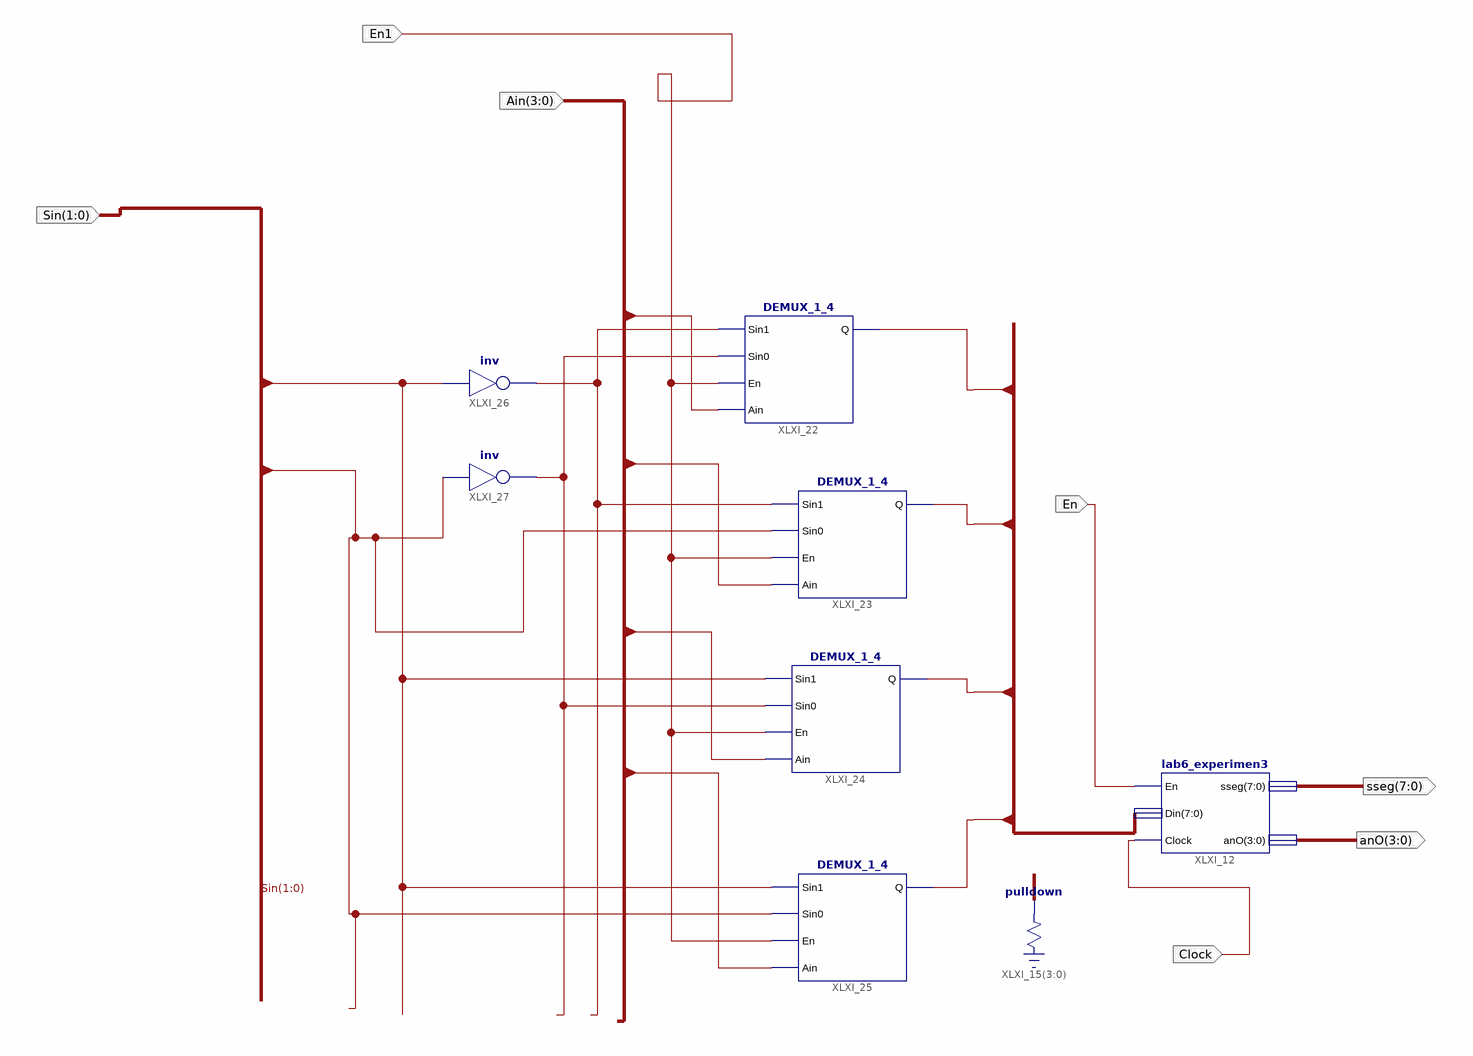
[diagram p0: schematic sheet 1]
// Xilinx ISE schematic lab6_demux.sch (spartan3e) as structural Verilog: 8 symbols, 7 ports
module lab6_demux (
  input  [1:0] Sin,
  input  En,
  input  Clock,
  input  [3:0] Ain,
  input  En1,
  output [3:0] anO,
  output [7:0] sseg
);

  wire XLXN_94, XLXN_95;
  wire [7:0] Din;

  lab6_experimen3 XLXI_12 (.En(En), .Din(Din), .Clock(Clock), .sseg(sseg), .anO(anO));
  \pulldown  XLXI_15[3:0] (.O(Din[7:4]));
  DEMUX_1_4 XLXI_22 (.Sin1(XLXN_94), .Sin0(XLXN_95), .En(En1), .Ain(Ain[0]), .Q(Din[0]));
  DEMUX_1_4 XLXI_23 (.Sin1(XLXN_94), .Sin0(Sin[0]), .En(En1), .Ain(Ain[1]), .Q(Din[1]));
  DEMUX_1_4 XLXI_24 (.Sin1(Sin[1]), .Sin0(XLXN_95), .En(En1), .Ain(Ain[2]), .Q(Din[2]));
  DEMUX_1_4 XLXI_25 (.Sin1(Sin[1]), .Sin0(Sin[0]), .En(En1), .Ain(Ain[3]), .Q(Din[3]));
  not XLXI_26 (XLXN_94, Sin[1]);
  not XLXI_27 (XLXN_95, Sin[0]);
endmodule
